# EAGLE schematic esquema (EAGLE 9.6.2)
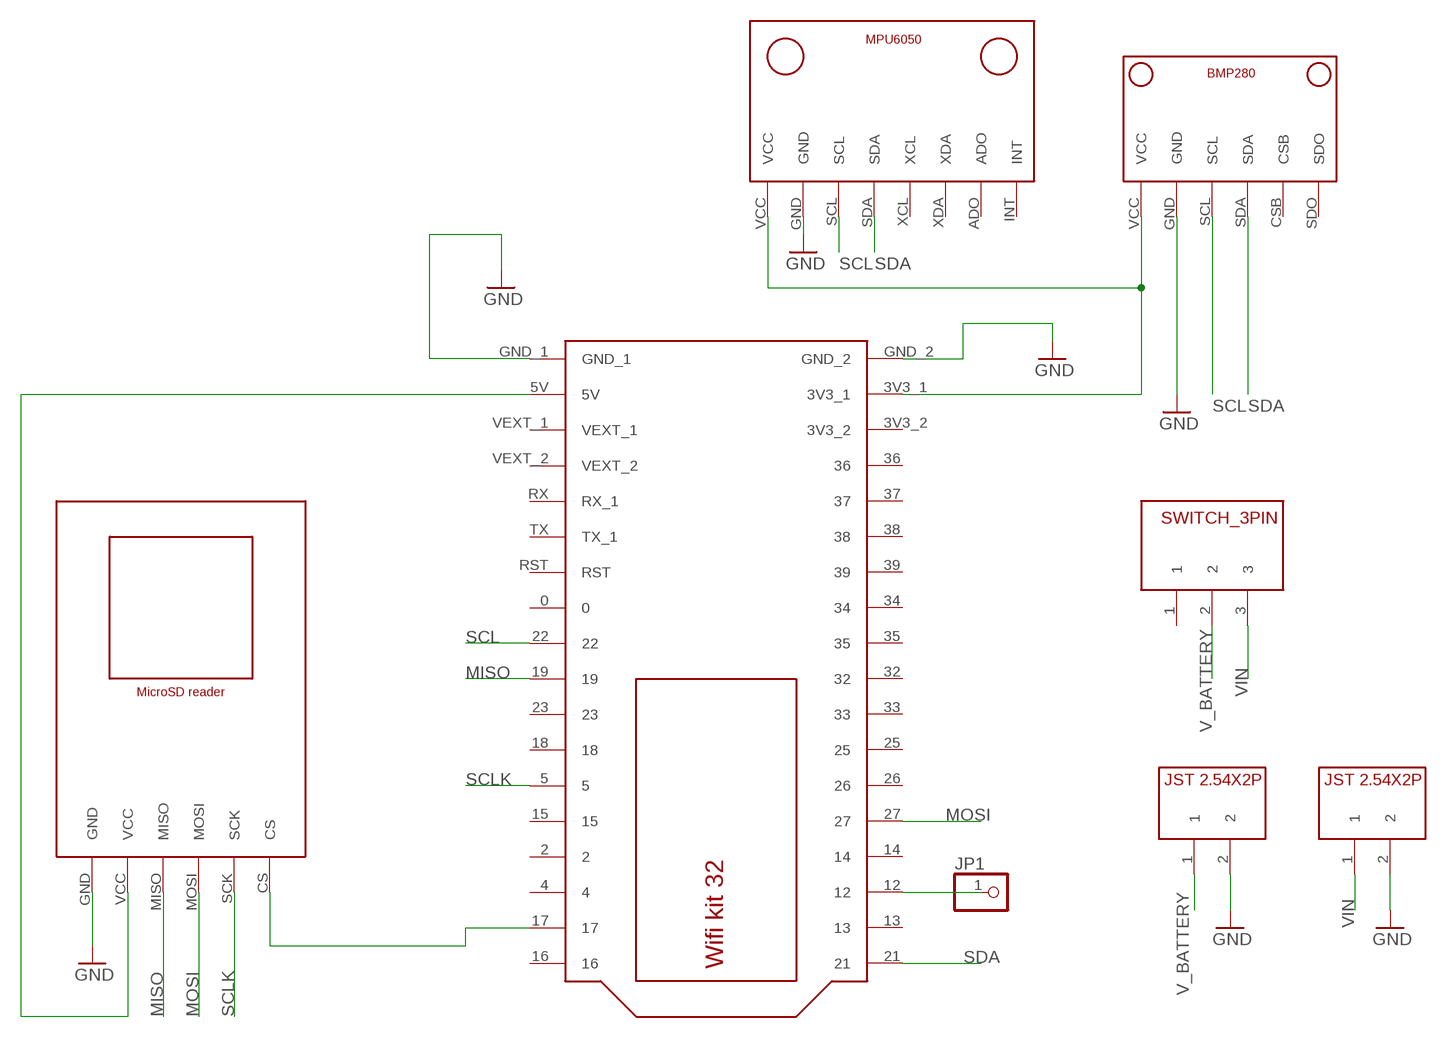
[diagram p0: schematic, sheet 1]

## Parts
JP1  PINHD-1X1  [1X01]
U$1  BMP280V1  [BMP280_FOOTPRINT]
U$2  MICROSD_READER  [MICROSD_READER_FOOTPRINT]
U$3  MPU6050V1  [MPU6050_FOOTPRINT]
U$4  WIFI_KIT32  [WIFI_KIT32]
U$5  JST2.54X2P  [JST2.54X2P_FOOTPRINT]
U$6  SWITCH_3PIN  [SWITCH_3PIN]
U$7  JST2.54X2P  [JST2.54X2P_FOOTPRINT]

## Nets
GND: U$1.GND U$2.GND U$3.GND U$4.GND_1 U$4.GND_2 U$5.2 U$7.2
MISO: U$2.MISO U$4.19
MOSI: U$2.MOSI U$4.27
N$1: U$2.CS U$4.17
N$2: JP1.1 U$4.12
N$4: U$1.VCC U$3.VCC U$4.3V3_1
N$7: U$2.VCC U$4.5V
SCL: U$1.SCL U$3.SCL U$4.22
SCLK: U$2.SCK U$4.5
SDA: U$1.SDA U$3.SDA U$4.21
V_BATTERY: U$5.1 U$6.2
VIN: U$6.3 U$7.1
Unconnected: U$1.CSB U$1.SDO U$3.ADO U$3.INT U$3.XCL U$3.XDA U$4.0 U$4.2 U$4.3V3_2 U$4.4 U$4.13 U$4.14 U$4.15 U$4.16 U$4.18 U$4.23 U$4.25 U$4.26 U$4.32 U$4.33 U$4.34 U$4.35 U$4.36 U$4.37 U$4.38 U$4.39 U$4.RST U$4.RX(RX_1) U$4.TX(TX_1) U$4.VEXT_1 U$4.VEXT_2 U$6.1

## Library data of the parts
JP1 = pinhead:PINHD-1X1: PIN HEADER
U$1 = CRD:BMP280: Sensor barométrico
U$2 = CRD:MICROSD_READER: Leitor e gravador de cartão SD
U$3 = CRD:MPU6050: Acelerômetro e Giroscópio
U$4 = CRD:WIFI_KIT32: Placa de desenvolvimento ESP32 da Heltech
U$5 U$7 = CRD:JST2.54X2P: Conector JST 2 pinos (2.54mm de distância entre pinos)
U$6 = CRD:SWITCH_3PIN